# Altium schematic sheet Mobile Robot Remote Controller.SchDoc
size A4
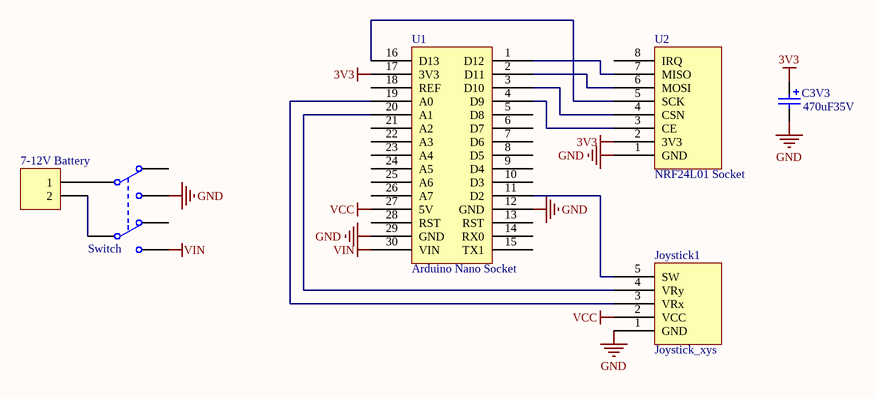
[diagram p0: Mobile Robot Remote Controller.SchDoc]

## Parts
7-12V_Battery  Header 2  [KF301-2P]  (value not drawn)
C3V3  value 470uF35V  [cp10x10]  (hidden comment: Cap Pol)
Joystick1  Joystick_xys  [Joystick_xys]
Switch  Push Switch  [Push Switch 7x7]  (value not drawn)
U1  Arduino Nano Socket  [arduino nano socket]
U2  NRF24L01 Socket  [nrf24l01 socket]

## Nets
3V3: C3V3.1 U1.17(3V3) U2.2(3V3)
GND: C3V3.2 Joystick1.1(GND) Switch.3(NO1) U1.12(GND) U1.29(GND) U2.1(GND)
VCC: Joystick1.2(VCC) U1.27(5V)
VIN: Switch.6(NO2) U1.30(VIN)
Net7-12V_Battery_1: 7-12V_Battery.1 Switch.1(COMMON1)
Net7-12V_Battery_2: 7-12V_Battery.2 Switch.4(COMMON2)
NetJoystick1_3: Joystick1.3(VRx) U1.19(A0)
NetJoystick1_4: Joystick1.4(VRy) U1.20(A1)
NetJoystick1_5: Joystick1.5(SW) U1.11(D2)
NetU1_1: U1.1(D12) U2.7(MISO)
NetU1_2: U1.2(D11) U2.6(MOSI)
NetU1_3: U1.3(D10) U2.4(CSN)
NetU1_4: U1.4(D9) U2.3(CE)
NetU1_16: U1.16(D13) U2.5(SCK)

Not connected (* = marked no-connect by the designer): Switch 2(NC1) 5(NC2); U1 5(D8) 6(D7) 7(D6) 8(D5) 9(D4) 10(D3) 13(RST) 14(RX0) 15(TX1) 18(REF) 21(A2) 22(A3) 23(A4) 24(A5) 25(A6) 26(A7) 28(RST); U2 8(IRQ)